# EAGLE design Carrier2 (EAGLE 9.6.2)
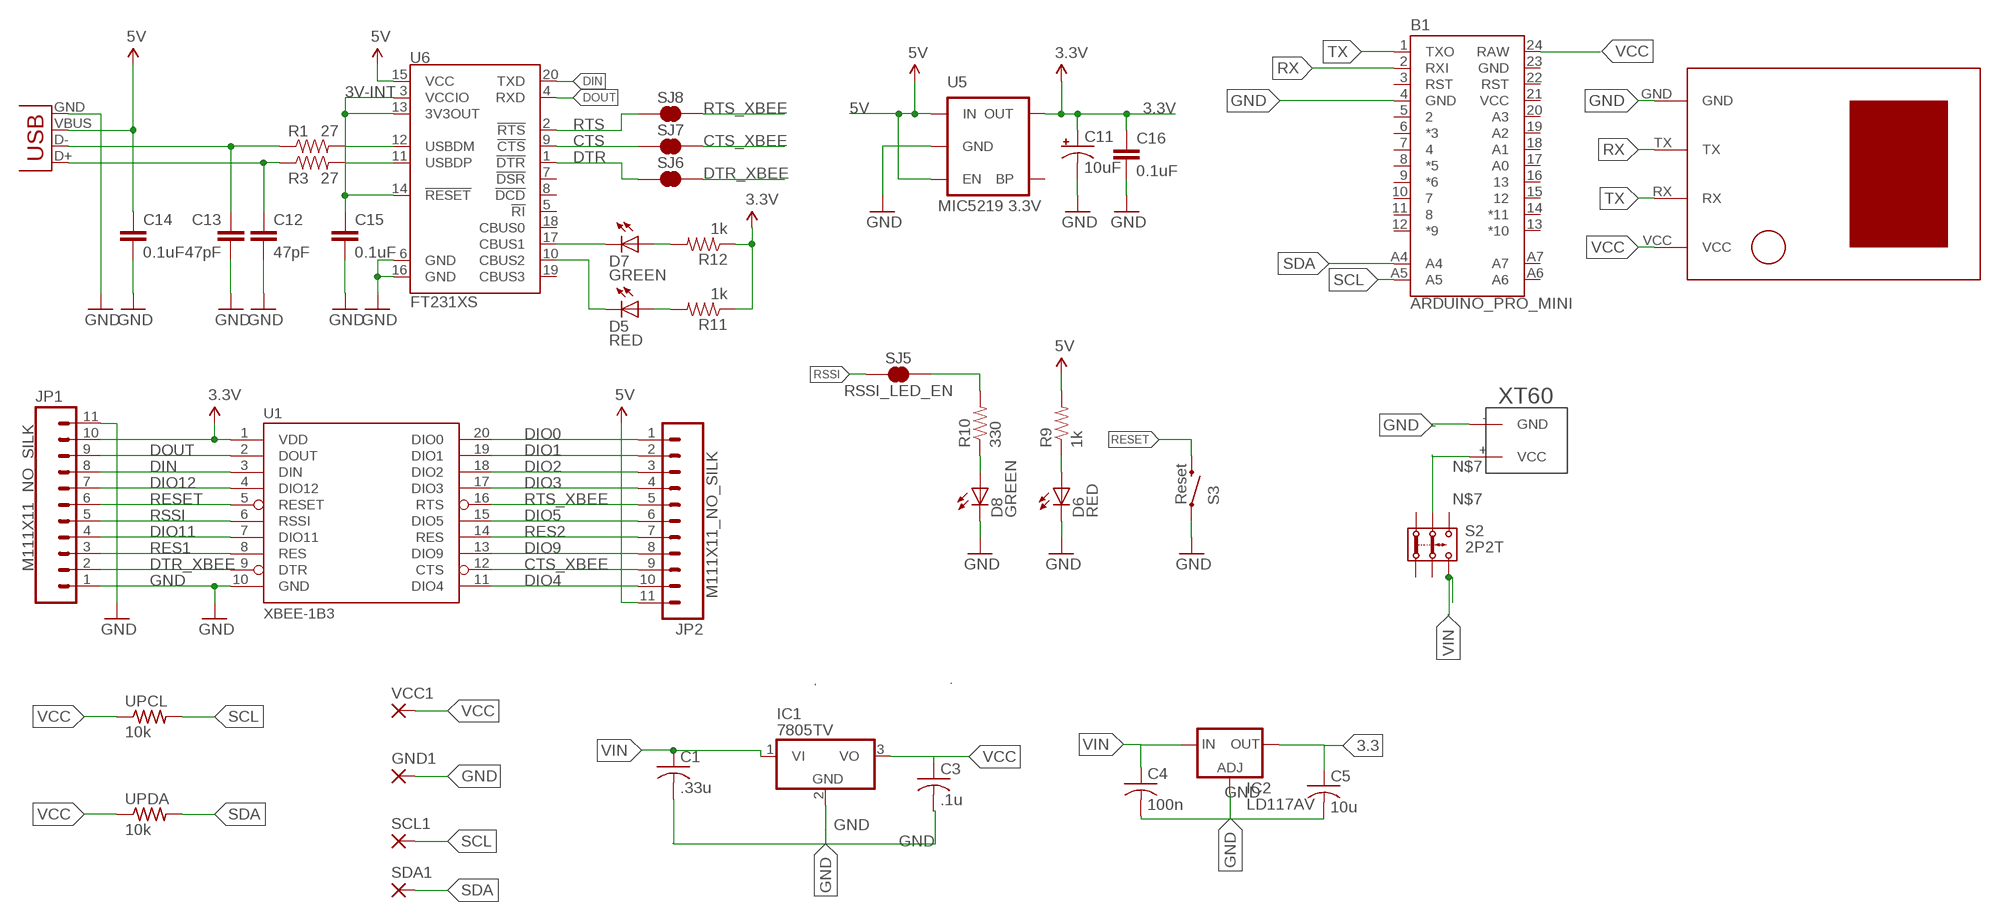
[diagram p0: schematic, sheet 1]

## Parts
B1  ARDUINO_PRO_MINI  [ARDUINO_PRO_MINI]
C1  .33u  C-USC0805  [C0805]
C3  .1u  C-USC0805  [C0805]
C4  100n  C-USC0805  [C0805]
C5  10u  C-USC0805  [C0805]
C11  10uF  CAP_POL1206  [EIA3216]
C12  47pF  CAP0603-CAP  [0603-CAP]
C13  47pF  CAP0603-CAP  [0603-CAP]
C14  0.1uF  CAP0603-CAP  [0603-CAP]
C15  0.1uF  CAP0603-CAP  [0603-CAP]
C16  0.1uF  CAP0603-CAP  [0603-CAP]
D5  RED  LED-RED0603  [LED-0603]
D6  RED  LED-RED0603  [LED-0603]
D7  GREEN  LED-GREEN0603  [LED-0603]
D8  GREEN  LED-GREEN0603  [LED-0603]
GND1  2,15/1,0  [2,15/1,0]
IC1  7805TV  [TO220V]
IC2  LD117AV  [TO220L1]
JP1  M111X11_NO_SILK  [1X11_NO_SILK]
JP2  M111X11_NO_SILK  [1X11_NO_SILK]
R1  27  RESISTOR0603-RES  [0603-RES]
R3  27  RESISTOR0603-RES  [0603-RES]
R9  1k  RESISTOR0603-RES  [0603-RES]
R10  330  RESISTOR0603-RES  [0603-RES]
R11  1k  RESISTOR0603-RES  [0603-RES]
R12  1k  RESISTOR0603-RES  [0603-RES]
S2  2P2T  [2P2T]
S3  Reset  SWITCH-MOMENTARY-2SMD  [TACTILE_SWITCH_SMD]
SCL1  2,15/1,0  [2,15/1,0]
SDA1  2,15/1,0  [2,15/1,0]
SJ5  RSSI_LED_EN  SOLDERJUMPERTRACE  [SJ_2S-TRACE]
SJ6  DTR  SOLDERJUMPERTRACE  [SJ_2S-TRACE]
SJ7  RTS_EN  SOLDERJUMPERTRACE  [SJ_2S-TRACE]
SJ8  CTS_EN  SOLDERJUMPERTRACE  [SJ_2S-TRACE]
U1  XBEE-1B3  [XBEE-SMD]
U5  MIC5219 3.3V  V_REG_LDOSMD  [SOT23-5]
U6  FT231XS  [SSOP20_L]
U$1  U-BLOX-NEO6V2  [U-BLOX-NEO6V2]
U$3  XT60  [XT60]
UPCL  10k  R-US_M0805  [M0805]
UPDA  10k  R-US_M0805  [M0805]
VCC1  2,15/1,0  [2,15/1,0]
X2  USBSMD  [USB-MINIB]

## Nets
3.3V: C11.A(+) C16.1 JP1.10 R11.1 R12.1 U1.1(VDD) U5.5(OUT)
3V-INT: C15.1 U6.3(VCCIO) U6.13(3V3OUT) U6.14(!RESET)
5V: C14.1 JP2.11 R9.2 U5.1(IN) U5.3(EN) U6.15(VCC) X2.VBUS
CTS: SJ7.1 U6.9(!CTS)
CTS_XBEE: JP2.9 SJ7.2 U1.12(CTS)
DIN: JP1.8 U1.3(DIN) U6.20(TXD)
DIO0: JP2.1 U1.20(DIO0)
DIO1: JP2.2 U1.19(DIO1)
DIO2: JP2.3 U1.18(DIO2)
DIO3: JP2.4 U1.17(DIO3)
DIO4: JP2.10 U1.11(DIO4)
DIO5: JP2.6 U1.15(DIO5)
DIO9: JP2.8 U1.13(DIO9)
DIO11: JP1.4 U1.7(DIO11)
DIO12: JP1.7 U1.4(DIO12)
DOUT: JP1.9 U1.2(DOUT) U6.4(RXD)
DTR: SJ6.1 U6.1(!DTR)
DTR_XBEE: JP1.2 SJ6.2 U1.9(DTR)
GND: B1.4(GND) C1.2 C3.2 C4.2 C5.2 C11.C(-) C12.2 C13.2 C14.2 C15.2 C16.2 D6.C D8.C GND1.1(P) IC1.2(GND) IC2.1(ADJ) JP1.1 JP1.11 S3.1 U1.10(GND) U5.2(GND) U6.6(GND) U6.16(GND) U$1.GND U$3.-(GND) X2.GND
N$1: C4.1 IC2.3(IN)
N$3: C3.1 IC1.3(VO)
N$6: C5.1 IC2.2(OUT)
N$7: S2.2.1 U$3.+(VCC)
N$18: D6.A R9.1
N$19: D5.A R11.2
N$20: D7.A R12.2
N$21: D8.A R10.1
N$22: D7.C U6.17(CBUS1)
N$23: C12.1 R3.1 X2.D+
N$24: C13.1 R1.1 X2.D-
N$25: R3.2 U6.11(USBDP)
N$26: R1.2 U6.12(USBDM)
N$27: R10.2 SJ5.2
RES1: JP1.3 U1.8(RES)
RES2: JP2.7 U1.14(RES)
RESET: JP1.6 S3.3 U1.5(RESET)
RSSI: JP1.5 SJ5.1 U1.6(RSSI)
RTS: SJ8.1 U6.2(!RTS)
RTS_XBEE: JP2.5 SJ8.2 U1.16(RTS)
RX: B1.2(RXI) U$1.TX
SCL: B1.A5 SCL1.1(P) UPCL.2
SDA: B1.A4 SDA1.1(P) UPDA.2
TX: B1.1(TXO) U$1.RX
TXLED1: D5.C U6.10(CBUS2)
VCC: B1.24(RAW) U$1.VCC UPCL.1 UPDA.1 VCC1.1(P)
VIN: C1.1 IC1.1(VI) S2.3.2
Unconnected: B1.3(RST) B1.5 B1.6(*3) B1.7 B1.8(*5) B1.9(*6) B1.10 B1.11 B1.12(*9) B1.13(*10) B1.14(*11) B1.15 B1.16 B1.17(A0) B1.18(A1) B1.19(A2) B1.20(A3) B1.22(RST) B1.A6 B1.A7 S2.1.1 S2.1.2 S2.2.2 S2.3.1 U5.4(BP) U6.5(!RI) U6.7(!DSR) U6.8(!DCD) U6.18(CBUS0) U6.19(CBUS3)

## Power pins joined to a net without a drawn wire
GND: B1.23(GND)
VCC: B1.21(VCC)

## Library data of the parts
B1 = SparkFun-Boards:ARDUINO_PRO_MINI: SparkFun Pro Mini Pro Mini compatible footprint. Dimensions: 0.7 x 1.3" PCB Thickness: 0.8mm SparkFun Products: 3.3V/8MHz <https://www.sparkfun.com/products/11114> 5V/16MHz <https://www.sparkfun.com/products/11113>
C1 C3-C5 = adafruit:C-US: CAPACITOR, American symbol
C11 = SparkFun:CAP_POL: Capacitor Polarized These are standard SMD and PTH capacitors. Normally 10uF, 47uF, and 100uF in electrolytic and tantalum varieties. Always verify the external diameter of the through hole cap, it varies with capacity, voltage, and manufacturer. The EIA devices should be standard.
C12-C16 = SparkFun-Capacitors:CAP: Capacitor Standard 0603 ceramic capacitor, and 0.1" leaded capacitor.
D5 D6 = SparkFun-LED:LED-RED: Assorted Red LEDs LilyPad 1206- DIO-09912 1206- DIO-00809 0603- DIO-00819; PROD_ID: DIO-00819
D7 D8 = SparkFun-LED:LED-GREEN: Various green LEDs Green LEDs used in SFE Production 0603- DIO-00821 LARGE- DIO-00862 LILYPAD- DIO-09910; PROD_ID: DIO-00821
GND1 SCL1 SDA1 VCC1 = wirepad:2,15/1,0: THROUGH-HOLE PAD
IC1 = linear:78*: Positive VOLTAGE REGULATOR Source: http://cache.national.com/ds/LM/LM78L05.pdf http://www.fairchildsemi.com/ds/LM/LM7805.pdf
IC2 = v-reg:LD117A?*: Low drop fixed and adjustable positive voltage regulators 1 A Source: http://www.st.com/stonline/products/literature/ds/7194/ld1117axx.pdf
JP1 JP2 = SparkFun-Connectors:M11: Header 11 Standard 11-pin 0.1" header. Use with straight break away headers (SKU : PRT-00116), right angle break away headers (PRT-00553), swiss pins (PRT-00743), machine pins (PRT-00117), and female headers (PRT-00115).
R1 R3 R9-R12 = SparkFun-Resistors:RESISTOR: Resistor Basic schematic elements and footprints for 0603, 1206, and PTH resistors.
S2 = switch:2P2T: SLIDE SWITCH 2P2T Part No. SS-22F05-G(A)4 Source: CANAL ELECTRONIC CO., LTD .. switsch.pdf
S3 = SparkFun-Electromechanical:SWITCH-MOMENTARY-2: Various NO switches- pushbuttons, reed, etc; PROD_ID: SWCH-08247
SJ5-SJ8 = SparkFun-Passives:SOLDERJUMPER: Solder Jumper Standard SMD solder jumper. Used to automate production. Two varients : Normally Open and Normally Closed are the same, but have different paste layers. NC will have a large amount of paste and should jumper during reflow.
U1 = SparkFun:XBEE-1
U5 = SparkFun:V_REG_LDO: Voltage Regulator LDO Standard 150mA LDO voltage regulator in SOT-23 layout. Micrel part MIC5205. BP (by-pass) pin is used to lower output noise with 470pF cap.
U6 = SparkFun-DigitalIC:FT231X: FTDI FT231X Full Speed USB to Full-handshake UART This USB2.0 Full Speed IC offers a compact bridge to full handshake UART interfaces. The device is a UART, capable of operating up to 3MBaud, with low power consumption (8mA). The FT231X includes the complete FT-X series feature set and enables USB to be added into a system design quickly and easily over a UART interface.
U$1 = u-blox neo-6m v2:U-BLOX-NEO6V2
U$3 = XT60:XT60: XT60
UPCL UPDA = adafruit:R-US_: RESISTOR, American symbol
X2 = SparkFun:USB: USB Connectors USB-B-PTH is fully proven SKU : PRT-00139 USB-miniB is fully proven SKU : PRT-00587 USB-A-PCB is untested. USB-A-H is throughly reviewed, but untested. Spark Fun Electronics SKU : PRT-00437 USB-B-SMT is throughly reviewed, but untested. Needs silkscreen touching up. USB-A-S has not been used/tested USB-MB-H has not been used/tested

## Net classes
0 default: width 0.203 mm

## Board
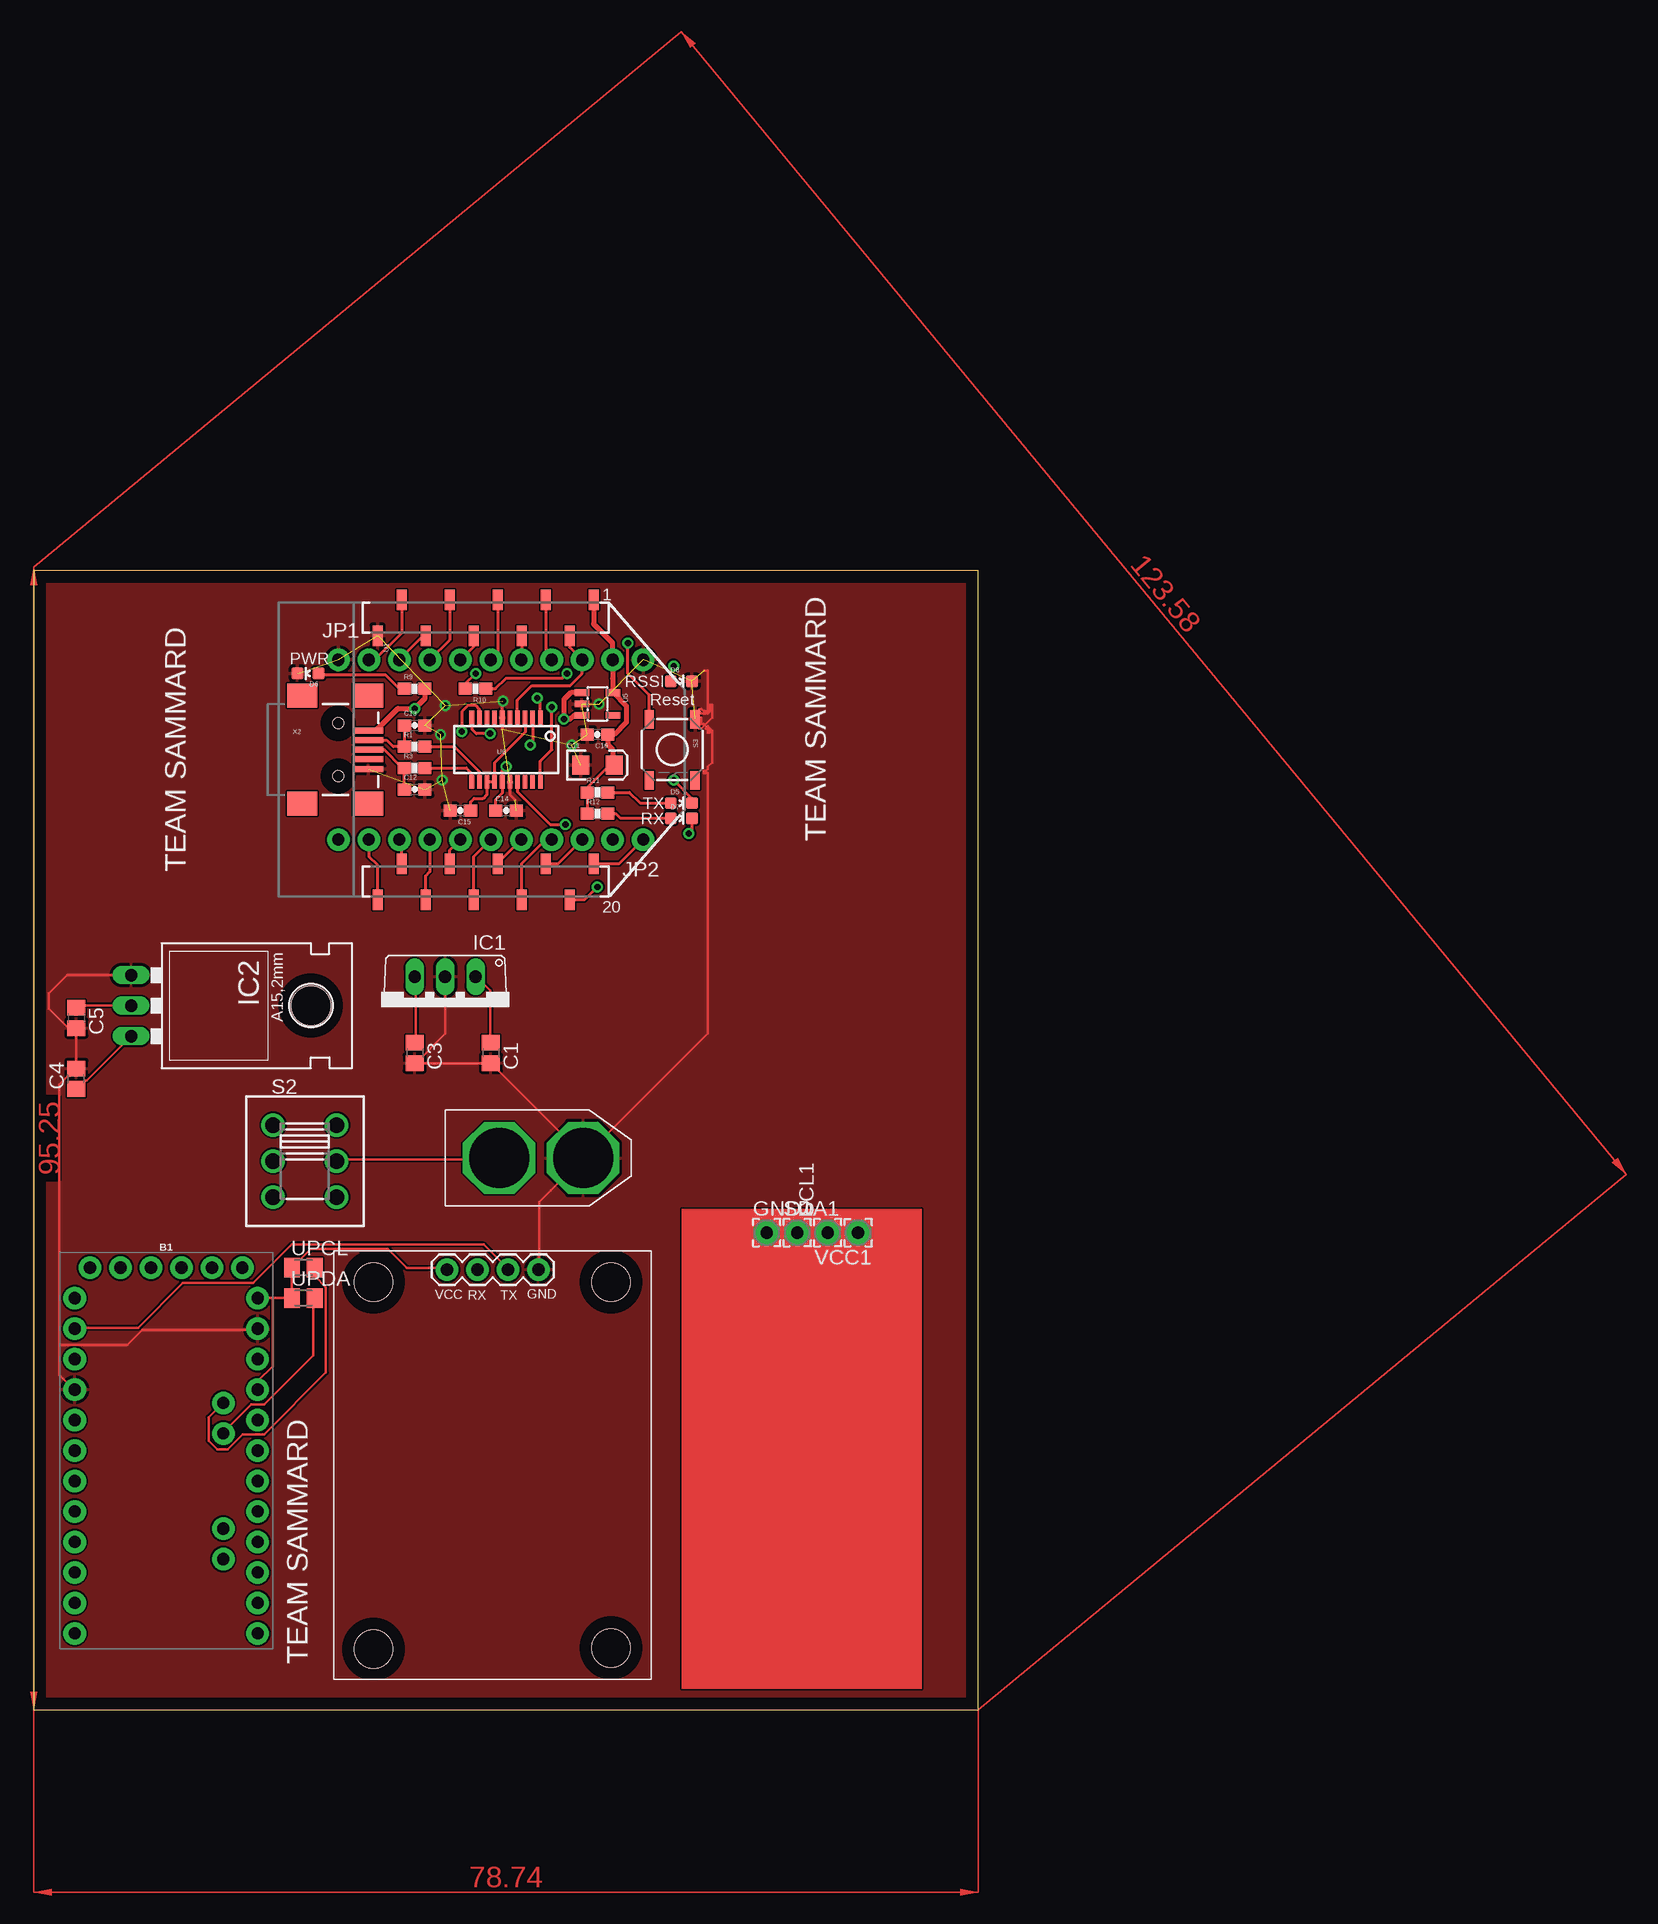
[diagram p1: board, top side]
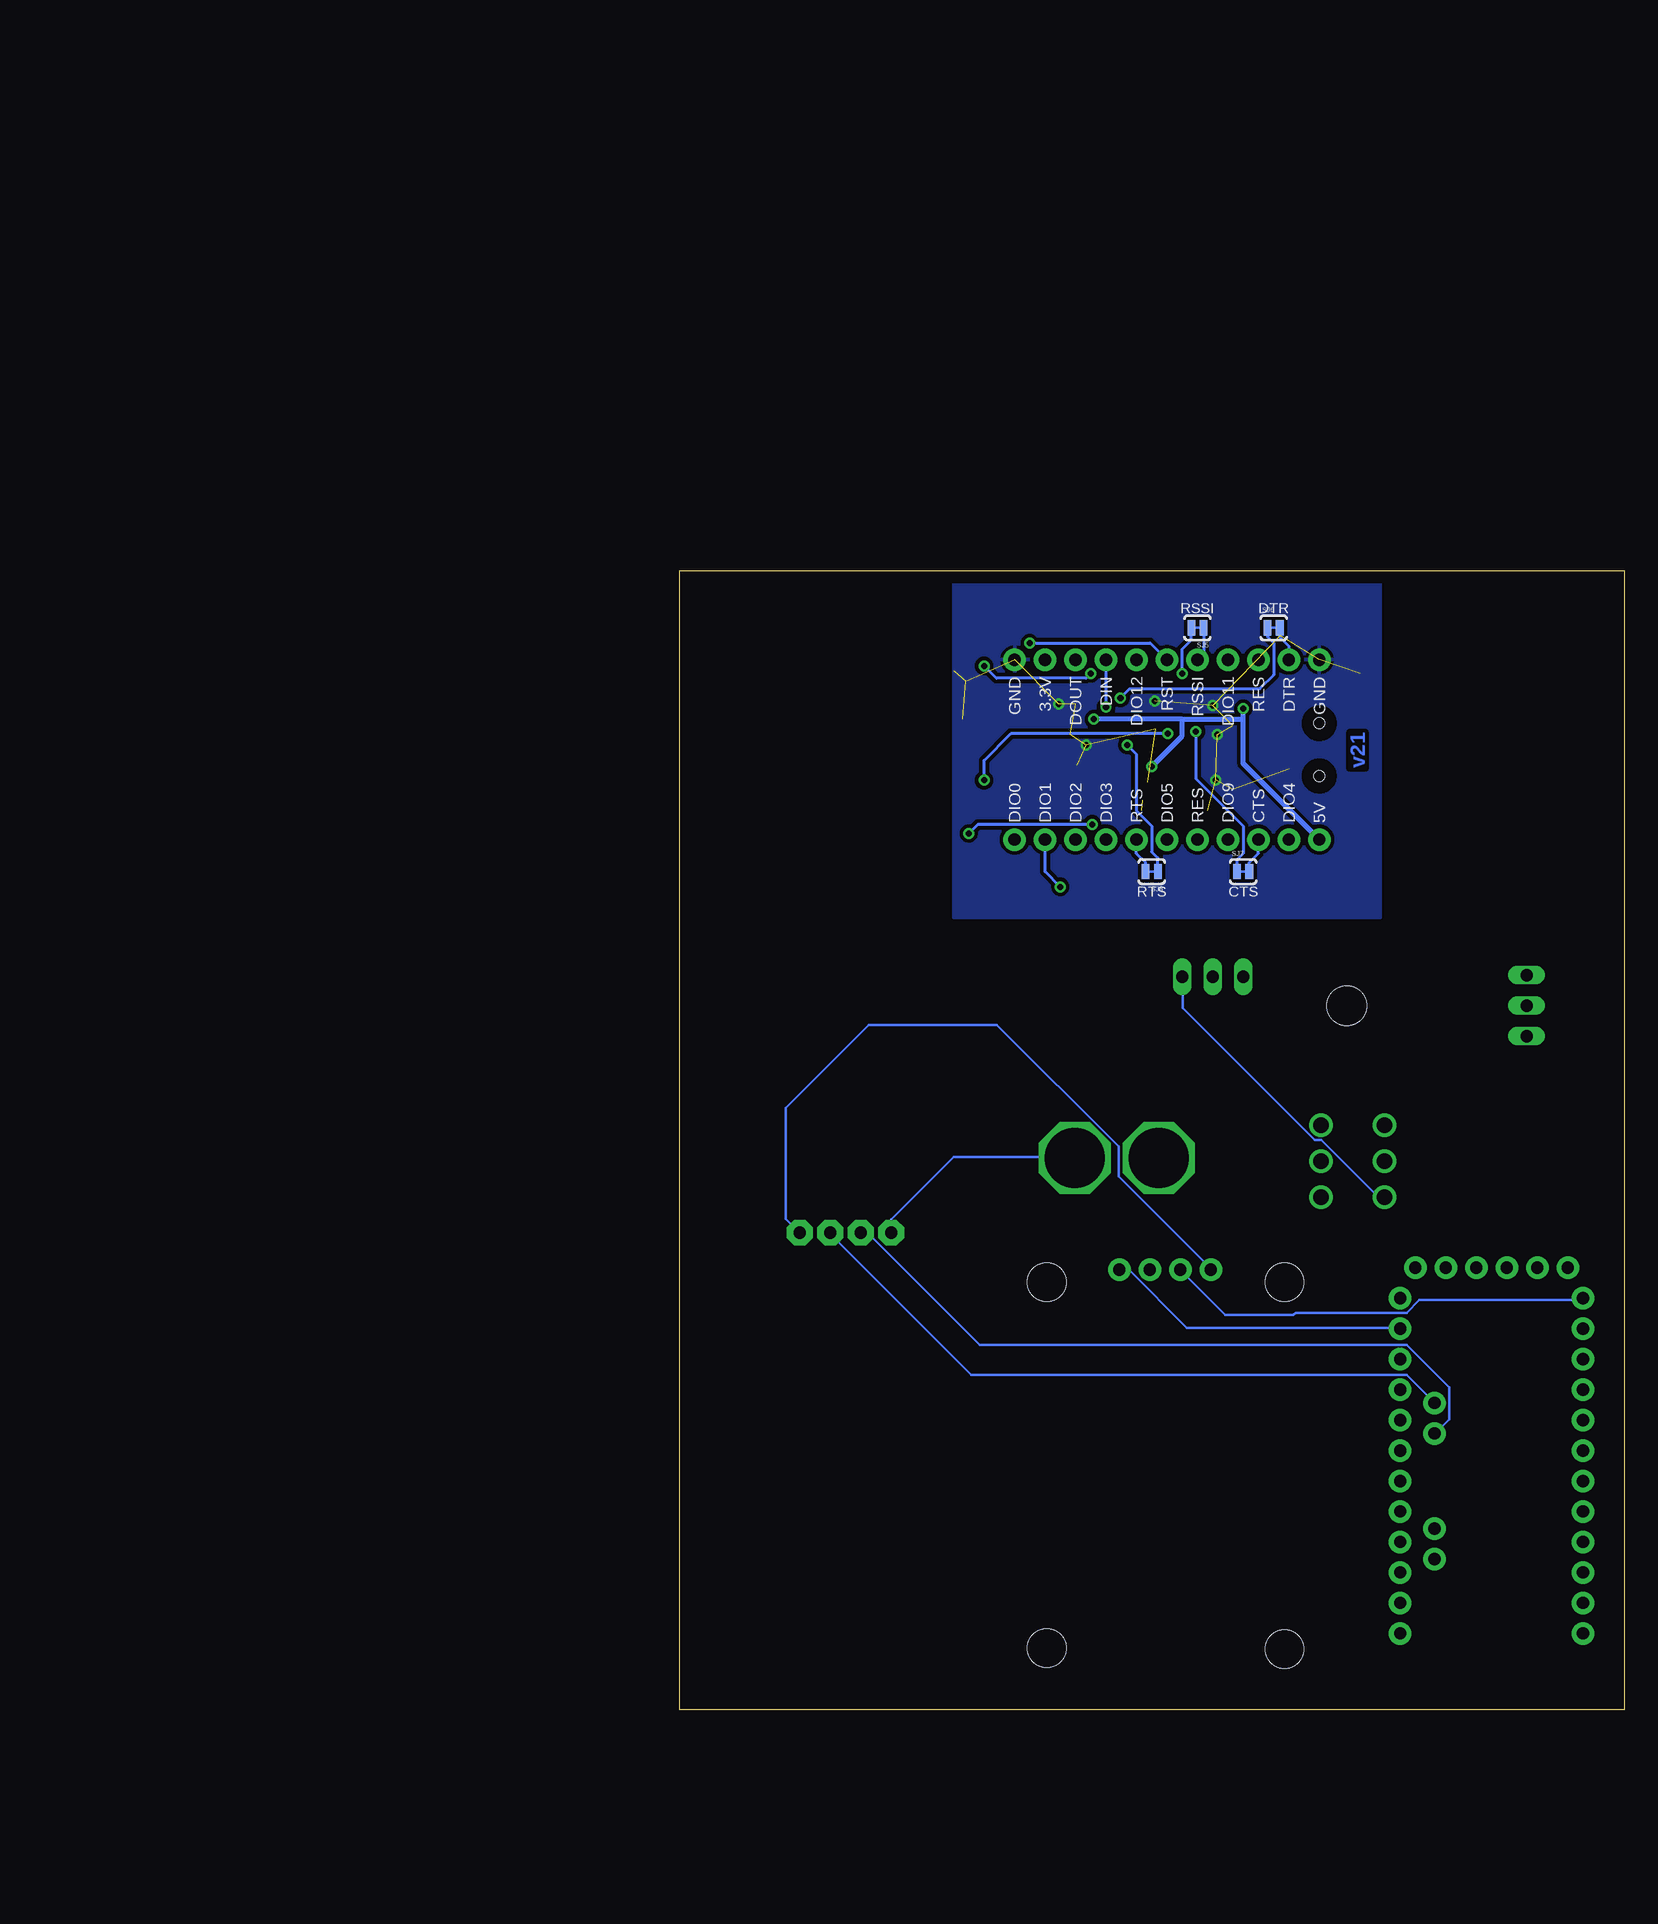
[diagram p2: board, bottom side, seen from below]

Size 78.72 x 94.92 mm. Coordinates in mm from the lower left corner, seen from the top.
Outline: 0,0 78.72,0 78.72,94.92 0,94.92 0,0
Copper layers (1*16): Top 0.035mm / dielectric 1.5mm / Bottom 0.035mm
Design rules "default": minimum track width 6mil, minimum drill 0.35mm, track to track 6mil, track to pad 6mil, pad to pad 6mil, via to via 6mil, smd to smd 6mil, copper to edge 40mil, drill to drill 6mil, minimum pad ring 10mil, minimum via ring 8mil, stop-mask expansion 4mil, vias tented up to drill 0mil, thermal gap 10mil

### Footprints (pad centres in the part's own frame; a part is rotated, then mirrored left to right if it is on the bottom)
ARDUINO_PRO_MINI = drill 1.016 pad 1.88: 1 -7.62,12.7; 2 -7.62,10.16; 3 -7.62,7.62; 4 -7.62,5.08; 5 -7.62,2.54; 6 -7.62,0; 7 -7.62,-2.54; 8 -7.62,-5.08; 9 -7.62,-7.62; 10 -7.62,-10.16; 11 -7.62,-12.7; 12 -7.62,-15.24; 13 7.62,-15.24; 14 7.62,-12.7; 15 7.62,-10.16; 16 7.62,-7.62; 17 7.62,-5.08; 18 7.62,-2.54; 19 7.62,0; 20 7.62,2.54; 21 7.62,5.08; 22 7.62,7.62; 23 7.62,10.16; 24 7.62,12.7; A4 4.763,1.429; A5 4.763,3.969; A6 4.763,-9.049; A7 4.763,-6.509; BLK -6.35,15.24; GND -3.81,15.24; GRN 6.35,15.24; RXI 1.27,15.24; TXO 3.81,15.24; VCC -1.27,15.24
C0805 = smd 1.3 x 1.5: 1 -0.85,0; 2 0.85,0
EIA3216 = smd 1.4 x 1.6: A 1.4,0; C -1.4,0
0603-CAP = smd 1.1 x 1: 1 -0.85,0; 2 0.85,0
LED-0603 = smd 1 x 1: A 0,-0.877; C 0,0.877
2,15/1,0 = drill 1.016 pad 2.159 octagon: 1 0,0
TO220V = drill 1.016 long: 1 -2.54,-2.54; 2 0,-2.54; 3 2.54,-2.54
TO220L1 = drill 1.016 long: 1 -2.54,-3.81; 2 0,-3.81; 3 2.54,-3.81 | hole 3.302: 0,11.176
1X11_NO_SILK = drill 1.016 pad 1.88: 1 0,0; 2 2.54,0; 3 5.08,0; 4 7.62,0; 5 10.16,0; 6 12.7,0; 7 15.24,0; 8 17.78,0; 9 20.32,0; 10 22.86,0; 11 25.4,0
0603-RES = smd 1.1 x 1: 1 -0.85,0; 2 0.85,0
2P2T = drill 1.3 pad 1.93: 1.1 -3,2.65; 1.2 -3,-2.65; 2.1 0,2.65; 2.2 0,-2.65; 3.1 3,2.65; 3.2 3,-2.65
TACTILE_SWITCH_SMD = smd 1.524 x 0.762: 1 -2.54,1.905; 2 2.54,1.905; 3 -2.54,-1.905; 4 2.54,-1.905
SJ_2S-TRACE = smd 0.635 x 1.27: 1 -0.508,0; 2 0.508,0
XBEE-SMD = smd 1.7 x 0.85: 1 -12.5,20; 2 -9.5,18; 3 -12.5,16; 4 -9.5,14; 5 -12.5,12; 6 -9.5,10; 7 -12.5,8; 8 -9.5,6; 9 -12.5,4; 10 -9.5,2; 11 12.5,2; 12 9.5,4; 13 12.5,6; 14 9.5,8; 15 12.5,10; 16 9.5,12; 17 12.5,14; 18 9.5,16; 19 12.5,18; 20 9.5,20
SOT23-5 = smd 0.55 x 1.2: 1 -0.95,-1.3; 2 0,-1.3; 3 0.95,-1.3; 4 0.95,1.3; 5 -0.95,1.3
SSOP20_L = smd 0.381 x 1.143: 1 -2.857,-2.68; 2 -2.223,-2.68; 3 -1.587,-2.68; 4 -0.953,-2.68; 5 -0.318,-2.68; 6 0.318,-2.68; 7 0.953,-2.68; 8 1.587,-2.68; 9 2.223,-2.68; 10 2.857,-2.68; 11 2.857,2.68; 12 2.223,2.68; 13 1.587,2.68; 14 0.953,2.68; 15 0.318,2.68; 16 -0.318,2.68; 17 -0.953,2.68; 18 -1.587,2.68; 19 -2.223,2.68; 20 -2.857,2.68
U-BLOX-NEO6V2 = drill 1.016 pad 1.88: GND 17.05,34.13; RX 11.97,34.13; TX 14.51,34.13; VCC 9.43,34.13 | hole 3.2: 3.3,33.1; 23.1,33.1; 3.3,2.5; 23.1,2.6
XT60 = drill 5 octagon: + 4.5,0; - 11.5,0
M0805 = smd 1.3 x 1.6: 1 -0.95,0; 2 0.95,0
USB-MINIB = smd 2.5 x 0.5: D+ 2.5,0; D- 2.5,0.8; GND 2.5,-1.6; ID 2.5,-0.8; VBUS 2.5,1.6 | smd 2.5 x 2: GND@1 -3,-4.5; GND@2 -3,4.5; GND@3 2.5,4.5; GND@4 2.5,-4.5 | hole 0.9: 0,2.2; 0,-2.2

### Placement (x,y rotation side)
B1  11.05,21.59 0 top
C1  38.1,54.74 270 top
C3  31.75,54.74 270 top
C4  3.56,52.58 90 top
C5  3.56,57.66 270 top
C11  46.99,78.74 0 top
C12  31.75,76.71 0 top
C13  31.75,82.04 0 top
C14  39.37,74.93 0 top
C15  35.56,74.93 180 top
C16  46.99,81.28 180 top
D5  53.98,75.56 270 top
D6  22.86,86.36 90 top
D7  53.98,74.3 270 top
D8  53.98,85.72 270 top
GND1  61.09,39.75 0 top
IC1  34.29,58.55 180 top
IC2  11.94,58.67 270 top
JP1  25.4,87.5 0 top
JP2  50.8,72.52 180 top
R1  31.75,80.26 0 top
R3  31.75,78.49 0 top
R9  31.75,85.09 0 top
R10  36.83,85.09 180 top
R11  46.99,76.45 0 top
R12  46.99,74.68 0 top
S2  22.61,45.72 270 top
S3  53.21,80.01 270 top
SCL1  66.17,39.75 0 top
SDA1  63.63,39.75 0 top
SJ5  35.56,90.17 180 bottom
SJ6  29.21,90.17 0 bottom
SJ7  31.75,69.85 0 bottom
SJ8  39.37,69.85 180 bottom
U1  26.67,80.01 270 top
U5  46.99,83.82 270 top
U6  39.37,80.01 180 top
U$1  25.02,2.54 0 top
U$3  34.29,45.97 0 top
UPCL  22.48,36.83 0 top
UPDA  22.48,34.29 0 top
VCC1  68.71,39.75 180 top
X2  25.4,80.01 0 top

### Tracks (layer width: path | path; a pad name or v marks a point on that pad's centre or on a via)
3.3V
  Top 0.254: R12.1 R11.1 46.14,76.87 48.01,78.74 C11.A
  Top 0.406: U1.1 46.67,90.49 48.26,88.9 JP1.10 48.26,85.98 48.29,85.95 U5.5 49.4,83.66 49.4,82.3 48.39,81.28 C16.1 47.84,80.43 48.26,80.01 48.26,78.87 C11.A
3V-INT
  Top 0.254: C15.1 36.41,75.65 36.7,75.95 37.47,75.95 37.78,76.26 U6.13 U6.14 38.42,78.93 40.96,81.47 U6.3
5V  (via drill 0.51)
  Top 0.254: v39.37,78.61 39.05,78.3 U6.15 39.05,76.39 38.52,75.86 C14.1
  Top 0.406: X2.VBUS 28.52,81.61 30.35,83.44 v31.75,83.44 32.6,84.29 R9.2 | U5.3 45.02,82.87 44.7,82.55 v44.2,82.55 44.2,84.2 44.77,84.77 U5.1
  Bottom 0.406: 36.83,82.55 v44.2,82.55 | v39.37,78.61 36.83,81.15 36.83,82.55 | 31.75,82.55 31.75,78.87 JP2.11 | 31.75,82.55 v31.75,83.44 | 36.83,82.55 31.75,82.55
CTS  (via drill 0.51)
  Top 0.254: U6.9 37.15,83.38 36.83,83.69 36.2,83.69 35.69,83.19 v35.69,81.53
  Bottom 0.254: v35.69,81.53 35.69,77.6 31.75,73.66 31.75,71.37 32.26,70.87 SJ7.1
CTS_XBEE
  Top 0.254: U1.12 30.67,72.33 JP2.9
  Bottom 0.254: SJ7.2 31.24,70.61 30.48,71.37 JP2.9
DIN  (via drill 0.51)
  Top 0.254: U1.3 42.67,88.01 JP1.8 | U6.20 42.23,79.06 43.18,80.01 v43.18,83.57
  Bottom 0.254: v43.18,83.57 JP1.8
DIO0
  Top 0.254: U1.20 48.79,70.51 JP2.1
DIO1  (via drill 0.51)
  Top 0.254: U1.19 45.92,67.51 v46.99,68.58
  Bottom 0.254: v46.99,68.58 48.26,69.85 JP2.2
DIO2
  Top 0.254: U1.18 43.71,70.51 JP2.3
DIO3
  Top 0.254: U1.17 40.67,70.52 42.67,72.52 JP2.4
DIO4
  Top 0.254: JP2.10 27.94,71.12 28.67,70.39 U1.11
DIO5
  Top 0.254: U1.15 36.67,71.09 JP2.6
DIO9
  Top 0.254: U1.13 32.67,69.5 33.02,69.85 JP2.8
DIO11
  Top 0.254: JP1.4 34.67,89.15 U1.7
DIO12
  Top 0.254: U1.4 40.67,87.53 JP1.7
DOUT
  Top 0.254: U1.2 44.67,88.55 JP1.9 45.72,86.36 44.7,85.34 41.53,85.34 40.32,84.14 U6.4
DTR  (via drill 0.51)
  Top 0.254: U6.1 42.23,84.07 v41.97,84.33
  Bottom 0.254: v41.97,84.33 41.21,85.09 30.35,85.09 29.21,86.23 29.21,88.9 29.72,89.41 SJ6.1
DTR_XBEE
  Top 0.254: JP1.2 28.45,87.5 30.67,89.72 U1.9
  Bottom 0.254: SJ6.2 28.7,89.41 27.94,88.65 JP1.2
GND  (via drill 0.51)  (21 unrouted)
  Top 0.203: 44.45,44.63 45.7,45.87 U$3.- 45.87,46.05 | U$1.GND 42.14,36.8 42.14,42.32 43.09,43.27 44.45,44.63 | 2.13,30.4 2.13,27.91 3.38,26.67 B1.4 | 2.13,30.4 2.13,52.09 2.85,52.81 3.02,52.81 3.56,53.34 C4.2 C5.2 2.88,56.81 1.27,58.42 1.27,59.69 2.79,61.21 IC2.1 | 2.13,30.4 7.82,30.4 9.07,31.65 18.67,31.65 B1.23 | 55.88,86.59 56.19,86.59 56.19,83.21 56.01,83.03 55.65,83.03 55.47,83.21 55.47,83.39 55.65,83.39 55.83,83.21 56.01,83.21 56.19,83.03 56.36,83.21 56.36,83.74 56.54,83.74 56.54,82.68 55.65,81.79 55.47,81.79 55.47,82.68 55.65,82.68 55.65,82.14 55.83,82.14 56.36,81.61 56.36,81.43 56.19,81.43 56.19,81.61 56.01,81.79 56.19,81.97 56.54,81.61 56.54,78.94 56.19,78.59 56.19,78.41 56.01,78.23 55.83,78.23 55.83,78.05 56.19,78.05 56.19,56.36 45.87,46.05 | 31.83,53.87 38.05,53.87 C1.2 44.45,47.54 44.45,44.63 | 31.83,53.87 C3.2 | 31.83,53.87 34.29,56.34 IC1.2 | 45.87,46.12 45.87,46.05
  Top 0.254: U6.16 39.69,76.26 40.13,75.82 | 39.05,81.72 U6.6 39.05,84.01 v39.12,84.07
  Bottom 0.203: 61.16,39.83 GND1.1 61.09,40.84 55.88,46.05 45.87,46.05 U$3.- | U$1.GND 41.96,36.63 41.25,36.63 36.45,31.83 18.67,31.83 B1.23
  other vias: 44.83,80.39 34.04,77.47 33.91,81.28 47.12,83.82 34.29,83.69
  pour Bottom (isolate 0.305): 20.32,93.98 55.88,93.98 55.88,66.04 20.32,66.04
  pour Top (isolate 0.305): 20.32,93.98 55.88,93.98 55.88,66.04 20.32,66.04
  pour Top: 0,95.25 78.74,95.25 78.74,0 0,0
N$1
  Top 0.203: IC2.3 4.45,52.45 4.27,52.45 C4.1
N$3
  Top 0.203: C3.1 31.83,55.65 31.83,60.98 IC1.3
N$6
  Top 0.203: IC2.2 3.56,58.67 C5.1
N$7
  Top 0.203: S2.2.1 25.43,45.87 38.76,45.87 U$3.+
N$18
  Top 0.254: R9.1 30.48,85.09 29.34,86.23 23.86,86.23 D6.A
N$19
  Top 0.254: R11.2 49.66,76.45 50.55,75.56 D5.A
N$20
  Top 0.254: R12.2 48.51,74.68 48.9,74.3 D7.A
N$21  (via drill 0.51)
  Top 0.254: R10.1 38.48,85.09 39.37,85.98 44.07,85.98 v44.45,86.36 | D8.A 53.1,86.75 v53.34,87
  Bottom 0.254: v44.45,86.36 44.83,85.98 52.32,85.98 v53.34,87
N$22  (via drill 0.51)
  Top 0.254: U6.17 40.32,76.52 43.05,73.79 v44.32,73.79 | D7.C 54.85,73.27 v54.61,73.03
  Bottom 0.254: v44.32,73.79 53.85,73.79 v54.61,73.03
N$23
  Top 0.254: C12.1 R3.1 30.73,78.49 29.21,80.01 X2.D+
N$24
  Top 0.254: C13.1 R1.1 29.97,80.26 29.43,80.81 X2.D-
N$25
  Top 0.254: R3.2 36.07,78.49 36.51,78.04 U6.11
N$26
  Top 0.254: R1.2 35.05,80.26 37.15,78.17 U6.12
N$27  (via drill 0.51)
  Top 0.254: R10.2 35.98,85.51 v36.83,86.36
  Bottom 0.254: v36.83,86.36 36.83,88.39 36.07,89.15 SJ5.2
RES1
  Top 0.254: JP1.3 32.49,89.51 U1.8
RES2
  Top 0.254: U1.14 34.67,71.63 JP2.7
RESET  (via drill 0.51)
  Top 0.254: U1.5 38.67,88.07 JP1.6 | S3.3 51.31,84.58 49.53,86.36 v49.53,88.9
  Bottom 0.254: v49.53,88.9 39.5,88.9 JP1.6
RSSI
  Top 0.254: U1.6 36.67,88.61 JP1.5
  Bottom 0.254: SJ5.1 35.05,88.01 JP1.5
RTS  (via drill 0.51)
  Top 0.254: U6.2 41.59,80.58 v41.4,80.39
  Bottom 0.254: v41.4,80.39 40.64,79.63 40.64,74.93 39.37,73.66 39.37,71.5 38.86,70.99 SJ8.1
RTS_XBEE
  Top 0.254: U1.16 38.67,70.55 JP2.5
  Bottom 0.254: SJ8.2 39.88,70.61 40.64,71.37 JP2.5
RX
  Top 0.203: B1.2 3.56,31.83 8.71,31.83 12.45,35.56 18.31,35.56 21.51,38.76 37.52,38.76 39.47,36.8 U$1.TX
SCL
  Top 0.203: UPCL.2 23.47,36.8 23.47,36.09 24.36,35.2 24.36,28.09 19.2,22.94 17.42,22.94 16.18,21.69 15.29,21.69 14.58,22.4 14.58,24.36 15.65,25.43 B1.A5
  Bottom 0.203: 66.14,39.83 SCL1.1 66.14,39.65 54.41,27.91 18.14,27.91 15.82,25.6 B1.A5
SDA
  Top 0.203: UPDA.2 23.29,34.14 23.29,29.52 19.2,25.43 18.14,25.43 15.82,23.11 B1.A4
  Bottom 0.203: 63.48,39.83 SDA1.1 63.48,39.65 62.94,39.65 53.7,30.4 18.14,30.4 14.58,26.85 14.58,24.18 15.65,23.11 B1.A4
TX
  Bottom 0.203: B1.1 3.56,34.14 17.07,34.14 18.14,33.07 27.38,33.07 27.56,32.89 33.25,32.89 36.98,36.63 U$1.RX
TXLED1  (via drill 0.51)
  Top 0.254: U6.10 36.51,81.72 36.89,81.34 v38.04,81.34 | v53.34,77.47 54.85,75.96 D5.C
  Bottom 0.254: v38.04,81.34 51.12,81.34 53.34,79.12 v53.34,77.47
VCC
  Top 0.203: 21.51,34.31 21.51,36.8 UPCL.1 21.69,36.98 23.11,38.41 29.52,38.41 31.11,36.8 34.31,36.8 U$1.VCC | 19.91,34.31 18.67,34.31 B1.24 | 19.91,34.31 21.51,34.31 | 21.51,34.31 UPDA.1 | B1.21 18.67,27.38 19.91,28.63 19.91,34.31
  Bottom 0.203: 68.63,39.83 VCC1.1 69.85,40.89 69.85,50.16 62.94,57.07 52.27,57.07 42.14,46.94 42.14,44.45 34.49,36.8 U$1.VCC
VIN
  Top 0.203: C1.1 38.05,55.65 38.05,59.92 36.98,60.98 IC1.1
  Bottom 0.203: S2.3.2 20.09,42.85 20.62,42.85 25.25,47.47 25.78,47.47 36.8,58.5 36.8,60.98 IC1.1
(copper drawn outside any net)
  shapes: Top area x4

### Text on the board
Bottom: v21
tPlace: 1 | PWR | RSSI | Reset | TX | RX | 20
bPlace: DTR | RSSI | GND | DTR | RES | DIO11 | RSSI | RST | DIO12 | DIN | DOUT | 3.3V | GND | 5V | DIO4 | CTS | DIO9 | RES | DIO5 | RTS | DIO3 | DIO2 | DIO1 | DIO0 | CTS | RTS
tNames: TEAM SAMMARD | TEAM SAMMARD | TEAM SAMMARD